# Altium project Vreg_Learning_Platform.PrjPcb (part 4 of 5)

## Sheet Safety.SchDoc: <Project Name>
size A3; ApprovedBy: <Appr.>; Author: <Author>; CompanyName: Infineon Technologies AG; Engineer: <Rel.>; Organization: Infineon Technologies AG; Address1: IFAG DES S PS; Address2: Am Campeon 1-12  -  85579 Neubiberg  -  Germany; Address3: 85579 Neubiberg; Address4: Germany; DocumentNumber: 6; Revision: <Rev.>; SheetNumber: 6; SheetTotal: 9; Release: RC00; PageSetup: Record=PageOptions|CenterHorizontal=True|CenterVertical=True|PrintScale=1.01|XCorrection=1.00|YCorrection=1.00|PrintKind=0|BorderSize=5000000|LeftOffset=0|BottomOffset=0|Orientation=2|PaperLength=1000|PaperWidth=1000|Scale=100|PaperSource=7|PrintQuality=-4|MediaType=1|DitherType=10|PaperKind=A3|PrintScaleMode=1; Doc_ConfidentialStatus: <Doc_ConfidentialStatus>; Doc_Preliminary: <Doc_Preliminary>
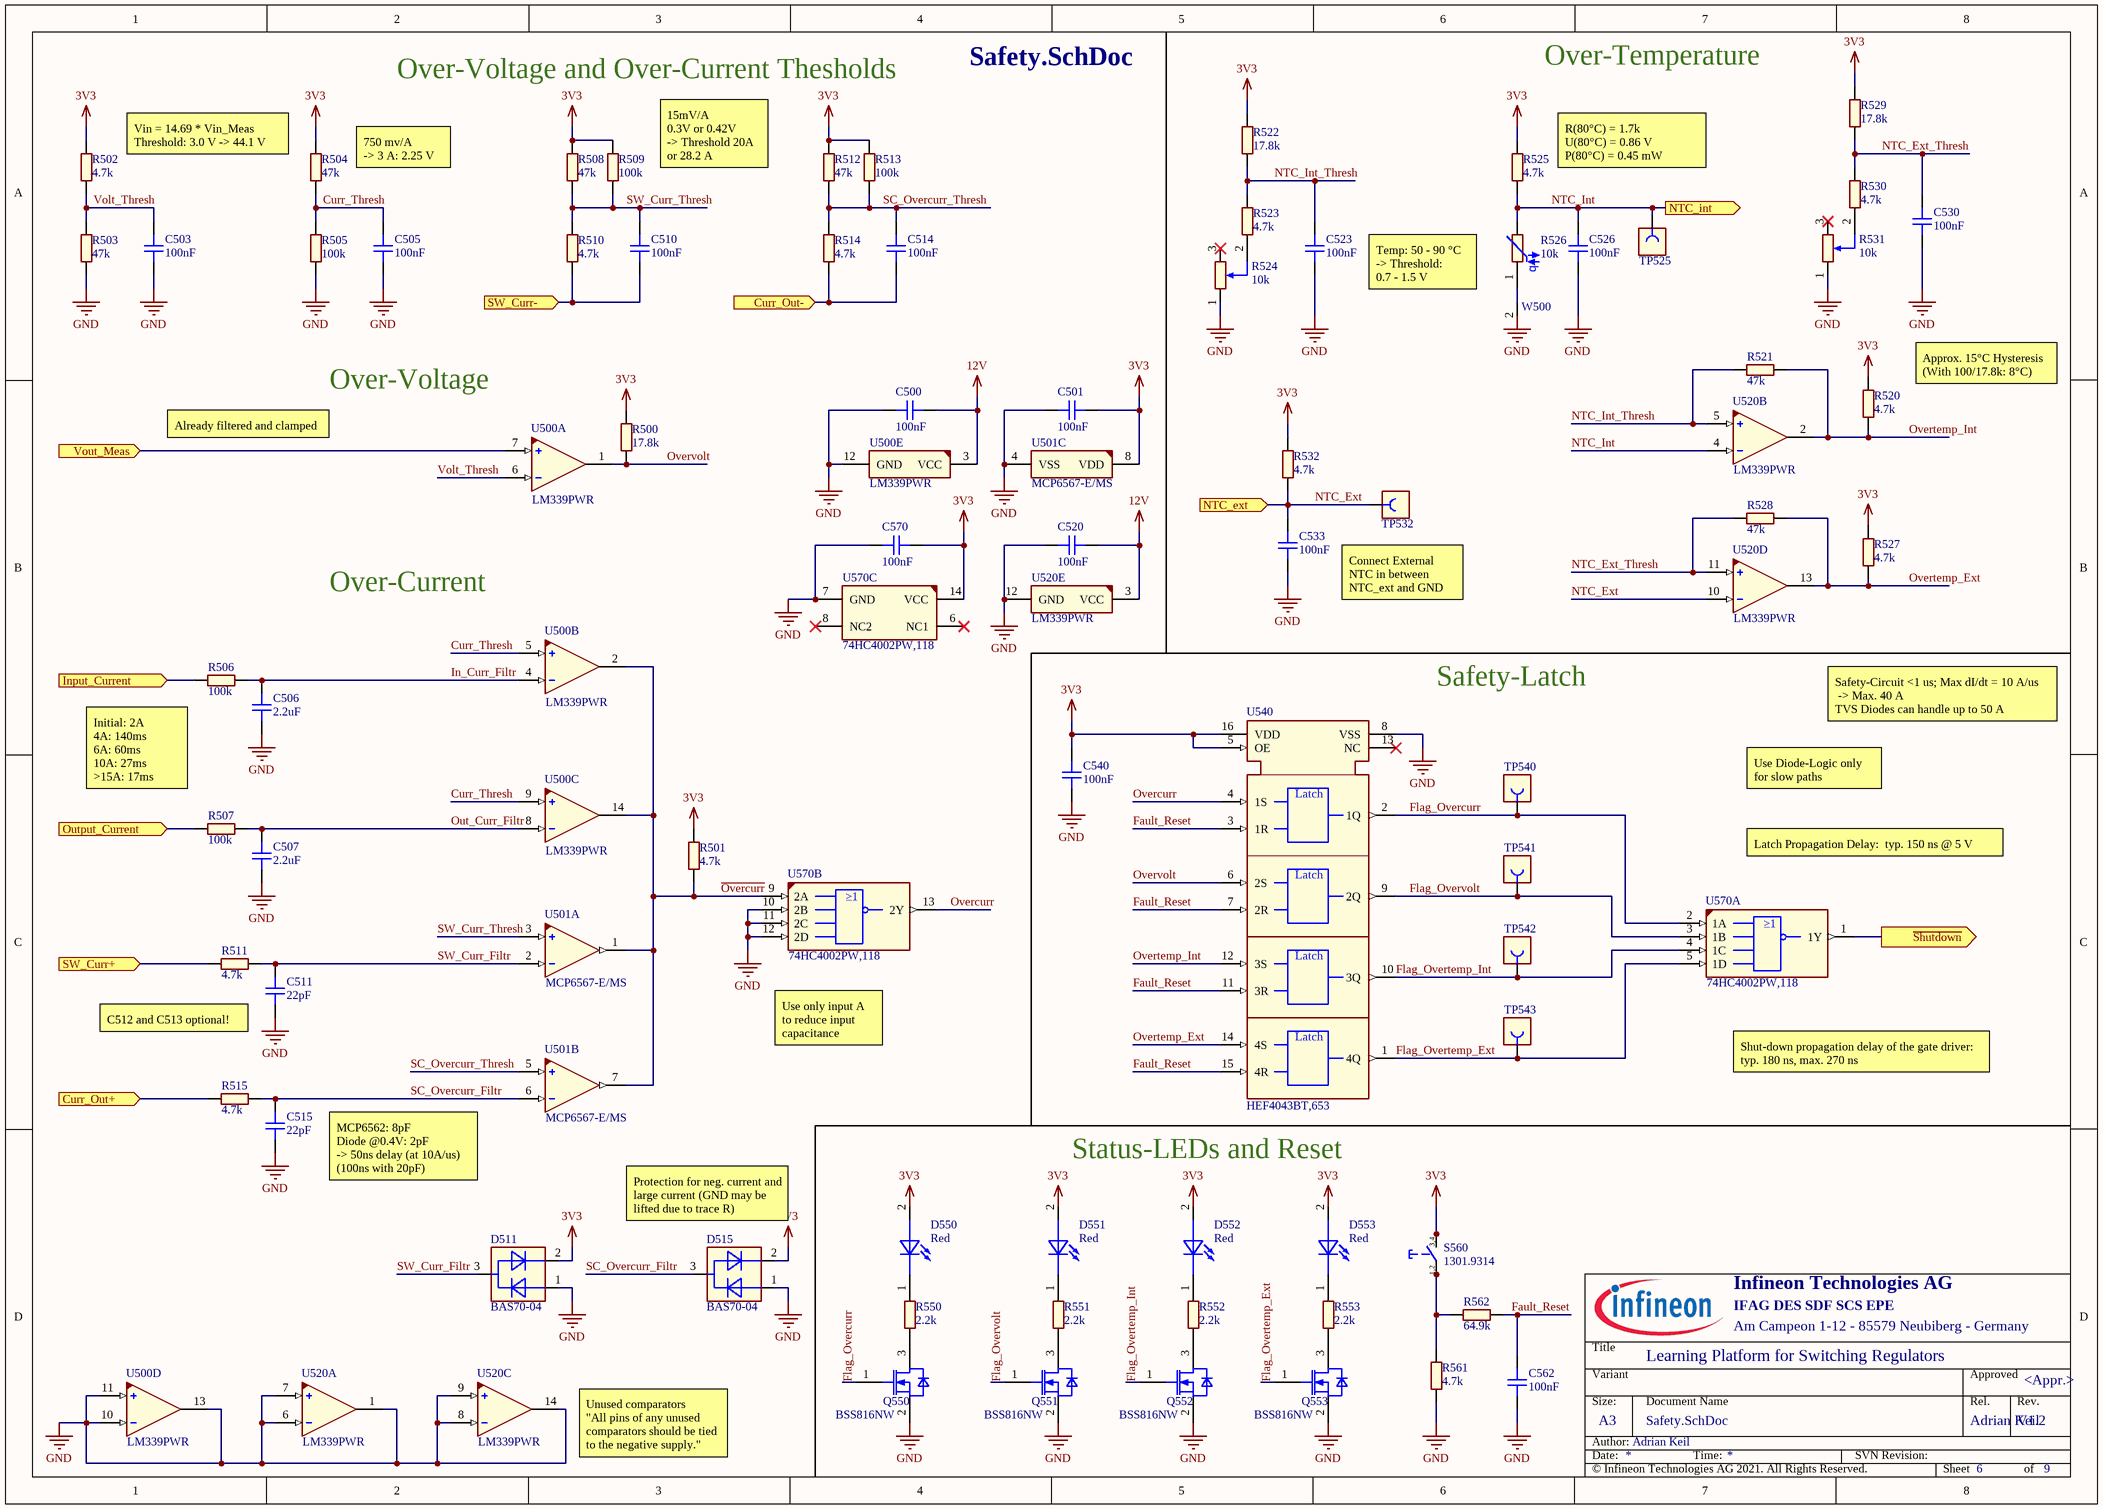
[diagram p4: Safety.SchDoc]

### Parts
C500  100nF  [CAPC1608X90N-2]
C501  100nF  [CAPC1608X90N-2]
C503  100nF  [CAPC1608X90N-2]
C505  100nF  [CAPC1608X90N-2]
C506  2.2uF  [CAPC1608X90N-3]
C507  2.2uF  [CAPC1608X90N-3]
C510  100nF  [CAPC1608X90N-2]
C511  22pF  [CAPC1608X90N-2]
C514  100nF  [CAPC1608X90N-2]
C515  22pF  [CAPC1608X90N-2]
C520  100nF  [CAPC1608X90N-2]
C523  100nF  [CAPC1608X90N-2]
C526  100nF  [CAPC1608X90N-2]
C530  100nF  [CAPC1608X90N-2]
C533  100nF  [CAPC1608X90N-2]
C540  100nF  [CAPC1608X90N-2]
C562  100nF  [CAPC1608X90N-2]
C570  100nF  [CAPC1608X90N-2]
D511  BAS70-04  [SOT95P240X110-3N-1]
D515  BAS70-04  [SOT95P240X110-3N-1]
D550  Red  [LEDSC160X80X80-2N-1]
D551  Red  [LEDSC160X80X80-2N-1]
D552  Red  [LEDSC160X80X80-2N-1]
D553  Red  [LEDSC160X80X80-2N-1]
Q550  BSS816NW  [SOT65P210X100-3N-1-V]
Q551  BSS816NW  [SOT65P210X100-3N-1-V]
Q552  BSS816NW  [SOT65P210X100-3N-1-V]
Q553  BSS816NW  [SOT65P210X100-3N-1-V]
R500  17.8k  [RESC1609X50N]
R501  4.7k  [RESC1609X50N]
R502  4.7k  [RESC1609X50N]
R503  47k  [RESC1609X50N]
R504  47k  [RESC1609X50N]
R505  100k  [RESC1609X50N]
R506  100k  [RESC1609X50N]
R507  100k  [RESC1609X50N]
R508  47k  [RESC1609X50N]
R509  100k  [RESC1609X50N]
R510  4.7k  [RESC1609X50N]
R511  4.7k  [RESC1609X50N]
R512  47k  [RESC1609X50N]
R513  100k  [RESC1609X50N]
R514  4.7k  [RESC1609X50N]
R515  4.7k  [RESC1609X50N]
R520  4.7k  [RESC1609X50N]
R521  47k  [RESC1609X50N]
R522  17.8k  [RESC1609X50N]
R523  4.7k  [RESC1609X50N]
R524  10k  [POT-SMD-3361P]
R525  4.7k  [RESC1609X50N]
R526  10k  [RESC1608X95N-1]
R527  4.7k  [RESC1609X50N]
R528  47k  [RESC1609X50N]
R529  17.8k  [RESC1609X50N]
R530  4.7k  [RESC1609X50N]
R531  10k  [POT-SMD-3361P]
R532  4.7k  [RESC1609X50N]
R550  2.2k  [RESC1609X50N]
R551  2.2k  [RESC1609X50N]
R552  2.2k  [RESC1609X50N]
R553  2.2k  [RESC1609X50N]
R561  4.7k  [RESC1609X50N]
R562  64.9k  [RESC1609X50N]
S560  1301.9314  [SW-SMD-1301.9314]
TP525  S1751-46R  [CON-SMD-TT-S1751-46]  (value not drawn)
TP532  S1751-46R  [CON-SMD-TT-S1751-46]  (value not drawn)
TP540  S1751-46R  [CON-SMD-TT-S1751-46]  (value not drawn)
TP541  S1751-46R  [CON-SMD-TT-S1751-46]  (value not drawn)
TP542  S1751-46R  [CON-SMD-TT-S1751-46]  (value not drawn)
TP543  S1751-46R  [CON-SMD-TT-S1751-46]  (value not drawn)
U500  LM339PWR  [SOP65P640X120-14N-1]  (parts A,B,C,D,E of 5)
U501  MCP6567-E/MS  [SOP65P490X110-8N-7-V]  (parts A,B,C of 3)
U520  LM339PWR  [SOP65P640X120-14N-1]  (parts A,B,C,D,E of 5)
U540  HEF4043BT,653  [SOIC127P600X175-16N-6]
U570  74HC4002PW,118  [SOP65P640X110-14N-1]  (parts A,B,C of 3)
W500  Net_Tie_2  [Net_Tie_Small_2P]  (value not drawn)  (net tie, no BOM)

### Ports
Curr_Out+ (in), Curr_Out- (in), Input_Current (in), NTC_ext (in), NTC_int (out), Output_Current (in), SW_Curr+ (in), SW_Curr- (in), Vout_Meas (in), ~{Shutdown} (out)

### Nets
3V3: C501.1 C540.2 C570.1 D511.2(CATHODE) D515.2(CATHODE) D550.2(Anode) D551.2(Anode) D552.2(Anode) D553.2(Anode) R500.1 R501.1 R502.1 R504.1 R508.1 R509.2 R512.1 R513.2 R520.1 R522.2 R525.1 R527.1 R529.2 R532.1 S560.3 S560.4 U501.8(VDD) U540.5(OE) U540.16(VDD) U570.14(VCC)
12V: C500.1 C520.1 U500.3(VCC) U520.3(VCC)
GND: C500.2 C501.2 C503.1 C505.1 C506.1 C507.1 C511.1 C515.1 C520.2 C523.1 C526.1 C530.1 C533.1 C540.1 C562.2 C570.2 D511.1(ANODE) D515.1(ANODE) Q550.2(SOURCE) Q551.2(SOURCE) Q552.2(SOURCE) Q553.2(SOURCE) R503.2 R505.1 R524.1 R531.1 R561.1 U500.10(4IN_N) U500.11(4IN_P) U500.12(GND) U500.13(4OUT) U501.4(VSS) U520.1(1OUT) U520.6(1IN_N) U520.7(1IN_P) U520.8(3IN_N) U520.9(3IN_P) U520.12(GND) U520.14(3OUT) U540.8(VSS) U570.7(GND) U570.10(2B) U570.11(2C) U570.12(2D) W500.2
~{Overcurr}: R501.2 U500.2(2OUT) U500.14(3OUT) U501.1(OUTA) U501.7(OUTB) U570.9(2A)
~{Shutdown}: U570.1(1Y) ; port ~{Shutdown}
Curr_Out+: R515.1 ; port Curr_Out+
Curr_Out-: C514.1 R514.2 ; port Curr_Out-
Curr_Thresh: C505.2 R504.2 R505.2 U500.5(2IN_P) U500.9(3IN_P)
Fault_Reset: C562.1 R562.2 U540.3(1R) U540.7(2R) U540.11(3R) U540.15(4R)
Flag_Overcurr: Q550.1(GATE) TP540.1 U540.2(1Q) U570.2(1A)
Flag_Overtemp_Ext: Q553.1(GATE) TP543.1 U540.1(4Q) U570.5(1D)
Flag_Overtemp_Int: Q552.1(GATE) TP542.1 U540.10(3Q) U570.4(1C)
Flag_Overvolt: Q551.1(GATE) TP541.1 U540.9(2Q) U570.3(1B)
In_Curr_Filtr: C506.2 R506.1 U500.4(2IN_N)
Input_Current: R506.2 ; port Input_Current
NTC_ext: C533.2 R532.2 TP532.1 U520.10(4IN_N) ; port NTC_ext
NTC_Ext_Thresh: C530.2 R528.1 R529.1 R530.1 U520.11(4IN_P)
NTC_int: C526.2 R525.2 R526.2 TP525.1 U520.4(2IN_N) ; port NTC_int
NTC_Int_Thresh: C523.2 R521.1 R522.1 R523.1 U520.5(2IN_P)
Out_Curr_Filtr: C507.2 R507.1 U500.8(3IN_N)
Output_Current: R507.2 ; port Output_Current
Overcurr: U540.4(1S) U570.13(2Y)
Overtemp_Ext: R527.2 R528.2 U520.13(4OUT) U540.14(4S)
Overtemp_Int: R520.2 R521.2 U520.2(2OUT) U540.12(3S)
Overvolt: R500.2 U500.1(1OUT) U540.6(2S)
SC_Overcurr_Filtr: C515.2 D515.3(ANODE_/_CATHODE) R515.2 U501.6(INB_N)
SC_Overcurr_Thresh: C514.2 R512.2 R513.1 R514.1 U501.5(INB_P)
SW_Curr+: R511.1 ; port SW_Curr+
SW_Curr-: C510.1 R510.2 ; port SW_Curr-
SW_Curr_Filtr: C511.2 D511.3(ANODE_/_CATHODE) R511.2 U501.2(INA_N)
SW_Curr_Thresh: C510.2 R508.2 R509.1 R510.1 U501.3(INA_P)
Volt_Thresh: C503.2 R502.2 R503.1 U500.6(1IN_N)
Vout_Meas: U500.7(1IN_P) ; port Vout_Meas
NetD550_1: D550.1(Cathode) R550.1
NetD551_1: D551.1(Cathode) R551.1
NetD552_1: D552.1(Cathode) R552.1
NetD553_1: D553.1(Cathode) R553.1
NetQ550_3: Q550.3(DRAIN) R550.2
NetQ551_3: Q551.3(DRAIN) R551.2
NetQ552_3: Q552.3(DRAIN) R552.2
NetQ553_3: Q553.3(DRAIN) R553.2
NetR523_2: R523.2 R524.2
NetR526_1: R526.1 W500.1
NetR530_2: R530.2 R531.2
NetR561_2: R561.2 R562.1 S560.1 S560.2

Not connected (* = marked no-connect by the designer): R524 3*; R531 3*; U540 13(NC)*; U570 6(NC1)* 8(NC2)*

### Notes on the sheet
- Over-Voltage and Over-Current Thesholds
- Over-Temperature
- Vin = 14.69 * Vin_Meas
  Threshold: 3.0 V -> 44.1 V
- (near R504) 750 mv/A
  -> 3 A: 2.25 V
- 15mV/A
  0.3V or 0.42V
  -> Threshold 20A or 28.2 A
- R(80°C) = 1.7k
  U(80°C) = 0.86 V
  P(80°C) = 0.45 mW
  Self-Heating: 1mW/℃ (at 25 °C)
- Temp: 50 - 90 °C
  -> Threshold:
  0.7 - 1.5 V
- (near R520) Approx. 15°C Hysteresis
  (With 100/17.8k: 8°C)
- Already filtered and clamped
- Over-Voltage
- Over-Current
- Connect External NTC in between NTC_ext and GND
- Safety-Latch
- Safety-Circuit <1 us; Max dI/dt = 10 A/us
  -> Max. 40 A
  TVS Diodes can handle up to 50 A
- Initial: 2A
  4A: 140ms
  6A: 60ms
  10A: 27ms
  >15A: 17ms
- Use Diode-Logic only for slow paths
- Latch Propagation Delay:  typ. 150 ns @ 5 V
- C512 and C513 optional!
- Use only input A to reduce input capacitance
- Shut-down propagation delay of the gate driver: typ. 180 ns, max. 270 ns
- MCP6562: 8pF
  Diode @0.4V: 2pF
  -> 50ns delay (at 10A/us)
  (100ns with 20pF)
- Status-LEDs and Reset
- (near D515) Protection for neg. current and large current (GND may be lifted due to trace R)
- (near U520) Unused comparators
  "All pins of any unused comparators should be tied to the negative supply."
- Title
- Variant
- Approved
- Date:
- Author:
- Size:
- A3
- Document Name
- Time:
- SVN Revision:
- Rel.
- Rev.
- Sheet
- of
- (in symbol 380147) 3,4; 1,2
- (in symbol 466242) q
- (in symbol 648079) Latch
- (in symbol 648286, part A) ≥1
- (in symbol 648286, part B) ≥1

### Library data of the parts
C500 C501 C503 C505 C510 C514 C520 C523 C526 C530 C533 C540 C562 C570 = 479045: CAP / CERA / 100nF / 50V / 10% / X7R (EIA) / -55°C to 125°C / 0603 / SMD / -; Multiple Parts: No; Manufacturer: AVX; Manufacturer Order Number: 06035C104KAT2A; Symbol Type: Capacitor; Single; Standard; 2 Pins; Alternate View: Yes; Article Number: 479045; Version Number: V01; Combined Parameters: TC:X7R (EIA);Tol.:-10%/+10%;Vdc:50V; QuickPick: 100nF / 50V / 10% / X7R (EIA) / 0603; Type: Standard; Style: Single; ComponentStatus: Released; PLMStatus: Active; Part Type: Capacitor; Value: 100nF; Tolerance Neg: 10%; Tolerance Pos: 10%; Application: Standard; Technology: Ceramic; Temperature min: -55; Temperature max: 125; Temperature Range: Military; ROHS Compliant: Y; Automotive Qualified: No; PackageReference: 0603; ComponentLink1Description: Vendor WebSite; ComponentLink1URL: http://www.avx.com; ComponentLink2Description: Datasheet; ComponentLink2URL: http://webnetprod.muc.infineon.com/PCBPortal_Prod/WorkFlows/AltiumComponent/StandardDocumentation?Versionid=479046; Supplier 1: Farnell; Supplier Part Number 1: 2280883; Supplier 2: DigiKey; Supplier Part Number 2: 478-5052-2-ND; Supplier 3: Mouser; Supplier Part Number 3: 581-06035C104KAT2A; Second Source allowed: Yes; Voltage DC (max): 50V; Package Description: Capacitor,non-polarized,Chip;1.60mm L X 0.81mm W X 0.90mm H
C506 C507 = 310650: CAP / CERA / 2.2uF / 25V / 10% / X5R (EIA) / -55°C to 85°C / 0603(1608) / SMD / -; Multiple Parts: No; Legacy PartNumber: CAP01010924; Manufacturer: MuRata; Manufacturer Order Number: GRM188R61E225KA12D; Symbol Type: Capacitor; Single; Standard; 2 Pins; Alternate View: Yes; Article Number: 310650; Version Number: V01; Combined Parameters: TC:X5R (EIA);Tol.:-10%/+10%;Vdc:25V; QuickPick: 2.2uF / 25V / 10% / X5R (EIA) / 0603 (1608M); Type: Standard; Style: Single; Package Metric: 1608; Package Imperial: 0603; ComponentStatus: Released; PLMStatus: Active; Legacy DeviceID: CAP01010924; Part Type: Capacitor; Value: 2.2uF; Tolerance Neg: 10%; Tolerance Pos: 10%; Technology: Ceramic; Temperature min: -55; Temperature max: 85; Temperature Range: Military; ROHS Compliant: Y; Automotive Qualified: No; PackageReference: 0603 (1608M); ComponentLink1Description: Vendor WebSite; ComponentLink1URL: http://www.murata.com/; ComponentLink2Description: Datasheet; ComponentLink2URL: http://webnetprod.muc.infineon.com/PCBPortal_Prod/WorkFlows/AltiumComponent/StandardDocumentation?Versionid=310651; Supplier 1: Farnell; Supplier Part Number 1: 1845734RL; Supplier 2: DigiKey; Supplier Part Number 2: 490-10731-2-ND; Supplier 3: Mouser; Supplier Part Number 3: 81-GRM188R61E225KA2D; Second Source allowed: Yes; Voltage DC (max): 25V; Package Description: Capacitor,non-polarized,Chip;1.60mm L X 0.80mm W X 0.90mm H
C511 C515 = 252438: CAP / CERA / 22pF / 50V / 10% / C0G (EIA) / NP0 / -55°C to 125°C / 0603 / SMD / -; Multiple Parts: No; Legacy PartNumber: CAP00400027; Manufacturer: AVX; Manufacturer Order Number: 06035A220K4T2A; Symbol Type: Capacitor; Single; Standard; 2 Pins; Alternate View: Yes; Article Number: 252438; Version Number: V01; Combined Parameters: TC:C0G (EIA) / NP0;Tol.:-10%/+10%;Vdc:50V; QuickPick: 22pF / 50V / 10% / C0G (EIA) / NP0 / 0603; Type: Standard; Style: Single; Automotive Qualified: AEC Q200; ComponentStatus: Released; PLMStatus: Active; Legacy DeviceID: CAP00400027; Part Type: Capacitor; Value: 22pF; Tolerance Neg: 10%; Tolerance Pos: 10%; Technology: Ceramic; Temperature min: -55; Temperature max: 125; Temperature Range: Military; ROHS Compliant: Y; PackageReference: 0603; ComponentLink1Description: Vendor WebSite; ComponentLink1URL: http://www.avx.com; ComponentLink2Description: Datasheet; ComponentLink2URL: http://webnetprod.muc.infineon.com/PCBPortal_Prod/WorkFlows/AltiumComponent/StandardDocumentation?Versionid=252439; Supplier 1: Farnell; Supplier 2: DigiKey; Supplier Part Number 2: 06035A220K4T2A-ND; Supplier 3: Mouser; Supplier Part Number 3: 581-06035A220K4T2A; Second Source allowed: Yes; Voltage DC (max): 50V; Package Description: Capacitor,non-polarized,Chip;1.60mm L X 0.81mm W X 0.90mm H
D511 D515 = 423882: Silicon Schottky Diode; Legacy PartNumber: IFX01400573; Manufacturer: Infineon Technologies; Symbol Type: Dual Diode Symbol 3 Pins, 1 Anode , 2 Cathode, 3 Anode, Cathode; Article Number: 423882; Version Number: V01; Combined Parameters: Vf:880mV;If:70mA;Ur:70V;Ir:100nA;Pmax:250mW; QuickPick: Schottky Diode / SOT23; Style: Single; Automotive Qualified: AEC Q101; ComponentStatus: Released; PLMStatus: Active; Second Source allowed: Yes; Voltage DC (max): na; Legacy DeviceID: IFX01400573; Part Type: Diode; Manufacturer Order Number: BAS70-04; Value: BAS70-04; Type: Schottky Diode; Application: Standard; Temperature min: -55; Temperature max: 125; Temperature Range: Military; ROHS Compliant: Y; PackageReference: SOT23; ComponentLink1Description: Vendor WebSite; ComponentLink1URL: https://www.infineon.com/; ComponentLink2Description: Datasheet; ComponentLink2URL: http://webnetprod.muc.infineon.com/PCBPortal_Prod/WorkFlows/AltiumComponent/StandardDocumentation?Versionid=423883; Supplier 1: Farnell; Supplier Part Number 1: 1056501; Supplier 2: DigiKey; Supplier Part Number 2: BAS7004E6327HTSA1TR-ND; Supplier 3: Mouser; Supplier Part Number 3: 726-BAS7004E6327HTSA; Package Description: SOT,0.95mm pitch;3 pin,1.30mm W X 2.90mm L X 1.10mm H body
D550-D553 = 625459: WL-SMCW SMT Mono-color Chip LED Waterclear, Red,630nm; Manufacturer: Wurth Elektronik; Manufacturer Order Number: 150060RS75000; Symbol Type: Standard LED Symbol, 1 Cathode, 2 Anode; Article Number: 625459; Version Number: V01; Combined Parameters: Vf:2.4V;If:30mA;Ur:5V;Ir:10uA;Pmax:72mW; QuickPick: LED / 1608 (0603); Style: Single; Automotive Qualified: No; ComponentStatus: Released; PLMStatus: Active; Second Source allowed: Yes; Voltage DC (max): na; Part Type: Diode; Value: Red; Type: LED; Application: Standard; Temperature min: -40; Temperature max: 85; Temperature Range: Industrial; ROHS Compliant: Y; PackageReference: 1608 (0603); ComponentLink1Description: Vendor WebSite; ComponentLink1URL: http://www.we-online.com; ComponentLink2Description: Datasheet; ComponentLink2URL: http://webnetprod.muc.infineon.com/PCBPortal_Prod/WorkFlows/AltiumComponent/StandardDocumentation?Versionid=625460; Supplier 1: Farnell; Supplier Part Number 1: 2322071; Supplier 2: DigiKey; Supplier Part Number 2: 732-4978-1-ND; Supplier 3: Mouser; Supplier Part Number 3: 710-150060RS75000; Package Description: LED,Side Concave; 2 pin,1.60mm W X 0.80mm L X 0.80mm H
Q550-Q553 = 644598: OptiMOS 2 Small-Signal-Transistor; Manufacturer: Infineon Technologies; Symbol Type: Insulated-Gate Field-Effect Transistor (IGFET), N-Channel, Depletion,  Body Diode, Pin 1 Gate, 2 Source, 3 Drain, 3 Pins; Article Number: 644598; Version Number: V01; Legacy DeviceID: IFX_BSS816NW; Combined Parameters: N-Channel Enhancement;Uds:20V;Id:1.4A;Rds:240R;P:500mW; QuickPick: N-Channel Enhancement / 500mW / 1.4A / 20V / PG-SOT323-3-2; Type: N-Channel Enhancement; Style: Single; Automotive Qualified: AEC Q101; ComponentStatus: Released; PLMStatus: Active; Second Source allowed: Yes; Voltage DC (max): na; Part Type: Transistor FET; Manufacturer Order Number: BSS816NW; Value: BSS816NW; Application: Small Signal; Temperature min: -55; Temperature max: 150; Temperature Range: Military; ROHS Compliant: Y; PackageReference: PG-SOT323-3-2; ComponentLink1Description: Vendor WebSite; ComponentLink1URL: https://www.infineon.com/; ComponentLink2Description: Datasheet; ComponentLink2URL: http://webnetprod.muc.infineon.com/PCBPortal_Prod/WorkFlows/AltiumComponent/StandardDocumentation?Versionid=644599; Supplier 1: Farnell; Supplier Part Number 1: 2617470; Supplier 2: DigiKey; Supplier Part Number 2: BSS816NWH6327XTSA1CT-ND; Supplier 3: Mouser; Supplier Part Number 3: 726-SP000917562; Package Description: SOT,0.65mm pitch;3 pin,1.25mm W X 2.00mm L X 1.00mm H body
R500 R522 R529 = 346302: RES / STD / 17.8k / 100mW / 1% / 100ppm/K / -55°C to 155°C / 0603 / SMD / -; Multiple Parts: No; Legacy PartNumber: RES01801283; Manufacturer: Vishay; Manufacturer Order Number: CRCW060317K8FK; Symbol Type: Resistor; Single; Standard; 2 Pins; Alternate View: Yes; Article Number: 346302; Version Number: V01; Combined Parameters: TCR:100ppm/K;Tol.:-1%/+1%;Vdc:75V;Idc:-;P:100mW; QuickPick: 17.8k / 1% / 0.1 / 0603; Style: Single; Automotive Qualified: AEC Q200; ComponentStatus: Released; PLMStatus: Active; Voltage DC (max): 75V; Legacy DeviceID: RES01801283; Part Type: Resistor; Value: 17.8k; Tolerance Neg: 1%; Tolerance Pos: 1%; Type: Standard; Technology: Thick Film; Temperature min: -55; Temperature max: 155; Temperature Range: Military; ROHS Compliant: Y; PackageReference: 0603; ComponentLink1Description: Vendor WebSite; ComponentLink1URL: http://www.vishay.com; ComponentLink2Description: Datasheet; ComponentLink2URL: http://webnetprod.muc.infineon.com/PCBPortal_Prod/WorkFlows/AltiumComponent/StandardDocumentation?Versionid=346303; Supplier 1: Farnell; Supplier 2: DigiKey; Supplier 3: Mouser; Second Source allowed: Yes
R501 R502 R510 R511 R514 R515 R520 R523 R525 R527 R530 R532 R561 = 345982: RES / STD / 4.7k / 100mW / 1% / 100ppm/K / -55°C to 155°C / 0603 / SMD / -; Multiple Parts: No; Legacy PartNumber: RES01801219; Manufacturer: Vishay; Manufacturer Order Number: CRCW06034K70FK; Symbol Type: Resistor; Single; Standard; 2 Pins; Alternate View: Yes; Article Number: 345982; Version Number: V01; Combined Parameters: TCR:100ppm/K;Tol.:-1%/+1%;Vdc:75V;Idc:-;P:100mW; QuickPick: 4.7k / 1% / 0.1 / 0603; Style: Single; Automotive Qualified: AEC Q200; ComponentStatus: Released; PLMStatus: Active; Voltage DC (max): 75V; Legacy DeviceID: RES01801219; Part Type: Resistor; Value: 4.7k; Tolerance Neg: 1%; Tolerance Pos: 1%; Type: Standard; Technology: Thick Film; Temperature min: -55; Temperature max: 155; Temperature Range: Military; ROHS Compliant: Y; PackageReference: 0603; ComponentLink1Description: Vendor WebSite; ComponentLink1URL: http://www.vishay.com; ComponentLink2Description: Datasheet; ComponentLink2URL: http://webnetprod.muc.infineon.com/PCBPortal_Prod/WorkFlows/AltiumComponent/StandardDocumentation?Versionid=345983; Supplier 1: Farnell; Supplier 2: DigiKey; Supplier 3: Mouser; Second Source allowed: Yes
R503 R504 R508 R512 R521 R528 = 346552: RES / STD / 47k / 100mW / 1% / 100ppm/K / -55°C to 155°C / 0603 / SMD / -; Multiple Parts: No; Legacy PartNumber: RES01801333; Manufacturer: Vishay; Manufacturer Order Number: CRCW060347K0FK; Symbol Type: Resistor; Single; Standard; 2 Pins; Alternate View: Yes; Article Number: 346552; Version Number: V01; Combined Parameters: TCR:100ppm/K;Tol.:-1%/+1%;Vdc:75V;Idc:-;P:100mW; QuickPick: 47k / 1% / 0.1 / 0603; Style: Single; Automotive Qualified: AEC Q200; ComponentStatus: Released; PLMStatus: Active; Voltage DC (max): 75V; Legacy DeviceID: RES01801333; Part Type: Resistor; Value: 47k; Tolerance Neg: 1%; Tolerance Pos: 1%; Type: Standard; Technology: Thick Film; Temperature min: -55; Temperature max: 155; Temperature Range: Military; ROHS Compliant: Y; PackageReference: 0603; ComponentLink1Description: Vendor WebSite; ComponentLink1URL: http://www.vishay.com; ComponentLink2Description: Datasheet; ComponentLink2URL: http://webnetprod.muc.infineon.com/PCBPortal_Prod/WorkFlows/AltiumComponent/StandardDocumentation?Versionid=346553; Supplier 1: Farnell; Supplier 2: DigiKey; Supplier Part Number 2: 541-47.0KHCT-ND; Supplier 3: Mouser; Second Source allowed: Yes
R505-R507 R509 R513 = 346742: RES / STD / 100k / 100mW / 1% / 100ppm/K / -55°C to 155°C / 0603 / SMD / -; Multiple Parts: No; Legacy PartNumber: RES01801371; Manufacturer: Vishay; Manufacturer Order Number: CRCW0603100KFK; Symbol Type: Resistor; Single; Standard; 2 Pins; Alternate View: Yes; Article Number: 346742; Version Number: V01; Combined Parameters: TCR:100ppm/K;Tol.:-1%/+1%;Vdc:75V;Idc:-;P:100mW; QuickPick: 100k / 1% / 0.1 / 0603; Style: Single; Automotive Qualified: AEC Q200; ComponentStatus: Released; PLMStatus: Active; Voltage DC (max): 75V; Legacy DeviceID: RES01801371; Part Type: Resistor; Value: 100k; Tolerance Neg: 1%; Tolerance Pos: 1%; Type: Standard; Technology: Thick Film; Temperature min: -55; Temperature max: 155; Temperature Range: Military; ROHS Compliant: Y; PackageReference: 0603; ComponentLink1Description: Vendor WebSite; ComponentLink1URL: http://www.vishay.com; ComponentLink2Description: Datasheet; ComponentLink2URL: http://webnetprod.muc.infineon.com/PCBPortal_Prod/WorkFlows/AltiumComponent/StandardDocumentation?Versionid=346743; Supplier 1: Farnell; Supplier Part Number 1: 1469649; Supplier 2: DigiKey; Supplier 3: Mouser; Second Source allowed: Yes
R524 R531 = 630020: RES / VAR / 10k / 500mW / 10% / 100ppm/K / -55°C to 125°C /  3 pin, 7.04 mm L X 6.71 mm W X 5.84 mm H Body / SMD / -; Multiple Parts: No; Manufacturer: Bourns; Manufacturer Order Number: 3361P-1-103GLF; Alternate View: Yes; Symbol Type: Resistor; Single; Variable; 3 Pins; Article Number: 630020; Version Number: V01; Combined Parameters: TCR:100ppm/K;Tol.:-10%/+10%;Vdc:-;Idc:-;P:500mW; QuickPick: 10k / 10% / 0.5 / SMD; Style: Single; ComponentStatus: Released; PLMStatus: Active; Part Type: Resistor; Value: 10k; Tolerance Neg: 10%; Tolerance Pos: 10%; Type: Variable; Application: Standard; Temperature min: -55; Temperature max: 125; Temperature Range: Military; ROHS Compliant: Y; Automotive Qualified: No; PackageReference: SMD; ComponentLink1Description: Vendor WebSite; ComponentLink1URL: http://www.bourns.com; ComponentLink2Description: Datasheet; ComponentLink2URL: http://webnetprod.muc.infineon.com/PCBPortal_Prod/WorkFlows/AltiumComponent/StandardDocumentation?Versionid=630021; Supplier 1: Farnell; Supplier Part Number 1: 1696060; Supplier 2: DigiKey; Supplier Part Number 2: 3361P-103GLFCT-ND; Supplier 3: Mouser; Supplier Part Number 3: 652-3361P-1-103GLF; Second Source allowed: Yes; Package Description: Potentiometer, SMD; 3 pin, 7.04 mm L X 6.71 mm W X 5.84 mm H Body
R526 = 466242: RES / NTC / 10k / 100mW / 1% / - / -40°C to 125°C / 0603(1608) / SMD / -; Multiple Parts: No; Legacy PartNumber: RES01806219; Manufacturer: MuRata; Manufacturer Order Number: NCP18XH103F03RB; Symbol Type: Resistor; Single; Negative Temperature Coefficient; 2 Pins; Alternate View: Yes; Article Number: 466242; Version Number: V01; Combined Parameters: TCR:-;Tol.:-1%/+1%;Vdc:-;Idc:-;P:100mW; QuickPick: 10k / 1% / 0.1 / 0603; Style: Single; Package Metric: 1608; Package Imperial: 0603; ComponentStatus: Released; PLMStatus: Active; Legacy DeviceID: RES01806219; Part Type: Resistor; Value: 10k; Tolerance Neg: 1%; Tolerance Pos: 1%; Type: Negative Temperature Coefficient (NTC); Temperature min: -40; Temperature max: 125; Temperature Range: Automotive; ROHS Compliant: Y; Automotive Qualified: No; PackageReference: 0603; ComponentLink1Description: Vendor WebSite; ComponentLink1URL: http://www.murata.com/; ComponentLink2Description: Datasheet; ComponentLink2URL: http://webnetprod.muc.infineon.com/PCBPortal_Prod/WorkFlows/AltiumComponent/StandardDocumentation?Versionid=466243; Supplier 1: Farnell; Supplier Part Number 1: 2456122RL; Supplier 2: DigiKey; Supplier Part Number 2: 490-4800-2-ND; Supplier 3: Mouser; Supplier Part Number 3: 81-NCP18XH103F03RB; Second Source allowed: Yes; Package Description: Resistor,Chip;1.60mm L X 0.80mm W X 0.95mm H
R550-R553 = 345782: RES / STD / 2.2k / 100mW / 1% / 100ppm/K / -55°C to 155°C / 0603 / SMD / -; Multiple Parts: No; Legacy PartNumber: RES01801179; Manufacturer: Vishay; Manufacturer Order Number: CRCW06032K20FK; Symbol Type: Resistor; Single; Standard; 2 Pins; Alternate View: Yes; Article Number: 345782; Version Number: V01; Combined Parameters: TCR:100ppm/K;Tol.:-1%/+1%;Vdc:75V;Idc:-;P:100mW; QuickPick: 2.2k / 1% / 0.1 / 0603; Style: Single; Automotive Qualified: AEC Q200; ComponentStatus: Released; PLMStatus: Active; Voltage DC (max): 75V; Legacy DeviceID: RES01801179; Part Type: Resistor; Value: 2.2k; Tolerance Neg: 1%; Tolerance Pos: 1%; Type: Standard; Technology: Thick Film; Temperature min: -55; Temperature max: 155; Temperature Range: Military; ROHS Compliant: Y; PackageReference: 0603; ComponentLink1Description: Vendor WebSite; ComponentLink1URL: http://www.vishay.com; ComponentLink2Description: Datasheet; ComponentLink2URL: http://webnetprod.muc.infineon.com/PCBPortal_Prod/WorkFlows/AltiumComponent/StandardDocumentation?Versionid=345783; Supplier 1: Farnell; Supplier 2: DigiKey; Supplier 3: Mouser; Second Source allowed: Yes
R562 = 346637: RES / STD / 64.9k / 100mW / 1% / 100ppm/K / -55°C to 155°C / 0603 / SMD / -; Multiple Parts: No; Legacy PartNumber: RES01801350; Manufacturer: Vishay; Manufacturer Order Number: CRCW060364K9FK; Symbol Type: Resistor; Single; Standard; 2 Pins; Alternate View: Yes; Article Number: 346637; Version Number: V01; Combined Parameters: TCR:100ppm/K;Tol.:-1%/+1%;Vdc:75V;Idc:-;P:100mW; QuickPick: 64.9k / 1% / 0.1 / 0603; Style: Single; Automotive Qualified: AEC Q200; ComponentStatus: Released; PLMStatus: Active; Voltage DC (max): 75V; Legacy DeviceID: RES01801350; Part Type: Resistor; Value: 64.9k; Tolerance Neg: 1%; Tolerance Pos: 1%; Type: Standard; Technology: Thick Film; Temperature min: -55; Temperature max: 155; Temperature Range: Military; ROHS Compliant: Y; PackageReference: 0603; ComponentLink1Description: Vendor WebSite; ComponentLink1URL: http://www.vishay.com; ComponentLink2Description: Datasheet; ComponentLink2URL: http://webnetprod.muc.infineon.com/PCBPortal_Prod/WorkFlows/AltiumComponent/StandardDocumentation?Versionid=346638; Supplier 1: Farnell; Supplier 2: DigiKey; Supplier 3: Mouser; Second Source allowed: Yes
S560 = 380147: Pushbutton Tactile Switch, Single Pole Single Throw, 4 Pins; Legacy PartNumber: CON01500305; Manufacturer: Schurter; Symbol type: Tactile Switch, Spring Return, Single Pole Single Throw - Normally Open, 4 Pins; Article Number: 380147; Version Number: V01; Legacy DeviceID: SCH_1301.9314; ComponentStatus: Released; PLMStatus: Active; Second Source allowed: Yes; Voltage DC (max): na; Part Type: Electro Mechanic; Manufacturer Order Number: 1301.9314; Value: 1301.9314; Temperature min: -20; Temperature max: 70; Temperature Range: Commercial; ROHS Compliant: Y; ComponentLink1Description: Vendor WebSite; ComponentLink1URL: http://www.schurter.com.sg/; ComponentLink2Description: Datasheet; ComponentLink2URL: http://webnetprod.muc.infineon.com/PCBPortal_Prod/WorkFlows/AltiumComponent/StandardDocumentation?Versionid=380148; Supplier 1: Farnell; Supplier Part Number 1: 1217763; Supplier 2: DigiKey; Supplier Part Number 2: 1301.9314-ND; Supplier 3: Mouser; Supplier Part Number 3: 693-1301.9314; Package Description: SMD Switch, 6.00mm L X 6.00mm W X 4.3mm H body
TP525 TP532 TP540-TP543 = 387486: Test Terminal, Surface Mount (Tape and Reeled Components); Multiple Parts: No; Legacy PartNumber: CON01501015; Manufacturer: Harwin; Symbol Type: Connector, 1 Lead, Female; Alternate View: Yes; Article Number: 387486; Version Number: V01; Legacy DeviceID: HAR_S1751-46R; Combined Parameters: Board-to-Cable None (onboard);1x1;Mounting:SMT;Orient:None (onboard);Shielded:No; QuickPick: None (onboard) / Board-to-Cable; Style: Not Applicable; ComponentStatus: Released; PLMStatus: Active; Voltage DC (max): na; Part Type: Connector; Manufacturer Order Number: S1751-46R; Value: S1751-46R; Type: Board-to-Cable; Application: Test; Temperature min: 0; Temperature max: 0; Temperature Range: Military; ROHS Compliant: Y; Automotive Qualified: No; ComponentLink1Description: Vendor WebSite; ComponentLink1URL: http://www.harwin.com/; ComponentLink2Description: Datasheet; ComponentLink2URL: http://webnetprod.muc.infineon.com/PCBPortal_Prod/WorkFlows/AltiumComponent/StandardDocumentation?Versionid=387487; Supplier 1: Farnell; Supplier Part Number 1: 2411184; Supplier 2: DigiKey; Supplier Part Number 2: 952-1478-2-ND; Supplier 3: Mouser; Supplier Part Number 3: 855-S1751-46R; Second Source allowed: Yes; Package Description: Test Terminal, SMD, 3.25mm L X 1.65mm W X 2.15mm H body
U500 U520 = 409035: Quad Differential Comparator; Legacy PartNumber: IC02600564; Manufacturer: Texas Instruments; Alternate View: Yes; Article Number: 409035; Version Number: V01; Legacy DeviceID: TI_LM339; Combined Parameters: Res.:-;Fmax:-; QuickPick: TSSOP-14 (PW); Automotive Qualified: No; ComponentStatus: Released; PLMStatus: Active; Voltage DC (max): na; Symbol Type: Quad Differential Comparator; Part Type: Analog Parts; Manufacturer Order Number: LM339PWR; Value: LM339PWR; Temperature min: 0; Temperature max: 0; Temperature Range: Military; PackageReference: TSSOP-14 (PW); ComponentLink1Description: Vendor WebSite; ComponentLink1URL: http://www.ti.com; ComponentLink2Description: Datasheet; ComponentLink2URL: http://webnetprod.muc.infineon.com/PCBPortal_Prod/WorkFlows/AltiumComponent/StandardDocumentation?Versionid=409036; Supplier 1: Farnell; Supplier Part Number 1: 2436009; Supplier 2: DigiKey; Supplier Part Number 2: 296-6607-2-ND; Supplier 3: Mouser; Supplier Part Number 3: 595-LM339PWR; Second Source allowed: Yes
U501 = 648281: Low-Power Open-Drain Output Comparator; Manufacturer: Microchip Technology; Alternate View: Yes; Article Number: 648281; Version Number: V00; Legacy DeviceID: MT_MCP6567-E/MS; Combined Parameters: Res.:-;Fmax:4MHz; QuickPick: Comparator / MSOP-8 (MS); Automotive Qualified: No; ComponentStatus: Released; PLMStatus: Active; Voltage DC (max): na; Multiple Parts: Yes; Symbol Type: Low-Power Open-Drain Output Comparator; Part Type: Analog Parts; Manufacturer Order Number: MCP6567-E/MS; Value: MCP6567-E/MS; Type: Comparator; Application: Power Electronics; Temperature min: -40; Temperature max: 125; Temperature Range: Automotive; ROHS Compliant: Y; PackageReference: MSOP-8 (MS); ComponentLink1Description: Vendor WebSite; ComponentLink1URL: http://www.microchip.com/; ComponentLink2Description: Datasheet; ComponentLink2URL: http://webnetprod.muc.infineon.com/PCBPortal_Prod/WorkFlows/AltiumComponent/StandardDocumentation?Versionid=648282; Supplier 1: Farnell; Supplier Part Number 1: 1834862; Supplier 2: DigiKey; Supplier Part Number 2: MCP6567-E/MS-ND; Supplier 3: Mouser; Supplier Part Number 3: 579-MCP6567-E/MS; Second Source allowed: Yes; Package Description: SOP,0.65mm pitch;8 pin,3.00mm W X 3.00mm L X 1.10mm H body
U540 = 648079: Quad R/S latch with 3-state outputs; Multiple Parts: No; Manufacturer: Nexperia; Article Number: 648079; Version Number: V00; Legacy DeviceID: NEX_HEF4043BT,653; Combined Parameters: - Digital;Vdc min/max:3V/15V;Iout:2.4mA;Fmax:-; QuickPick: SO-16; ComponentStatus: Released; PLMStatus: Active; Second Source allowed: Yes; Voltage DC (max): na; Symbol Type: Quad R/S latch with 3-state outputs; Alternate View: No; Part Type: Integrated Circuit; Manufacturer Order Number: HEF4043BT,653; Value: HEF4043BT,653; Type: Digital; Temperature min: -40; Temperature max: 85; Temperature Range: Industrial; ROHS Compliant: Y; Automotive Qualified: No; PackageReference: SO-16; ComponentLink1Description: Vendor WebSite; ComponentLink1URL: http://www.nexperia.com; ComponentLink2Description: Datasheet; ComponentLink2URL: http://webnetprod.muc.infineon.com/PCBPortal_Prod/WorkFlows/AltiumComponent/StandardDocumentation?Versionid=648080; Supplier 1: Farnell; Supplier 2: DigiKey; Supplier Part Number 2: 1727-1799-1-ND; Supplier 3: Mouser; Supplier Part Number 3: 771-HEF4043BT653; Package Description: SOIC,1.27mm pitch;16 pin,3.90mm W X 9.90mm L X 1.75mm H body
U570 = 648286: Dual 4-input NOR gate, Inputs also include clamp diodes that enable the use of current limiting resistors; Manufacturer: Nexperia; Alternate View: Yes; Article Number: 648286; Version Number: V00; Legacy DeviceID: NEX_74HC4002PW,118; Combined Parameters: Power Electronics Digital;Vdc min/max:2V/6V;Iout:25mA;Fmax:-; QuickPick: TSSOP14 (SOT402-1); Automotive Qualified: No; ComponentStatus: Released; PLMStatus: Active; Voltage DC (max): na; Symbol Type: Dual 4-input NOR gate; Multiple Parts: Yes; Part Type: Integrated Circuit; Manufacturer Order Number: 74HC4002PW,118; Value: 74HC4002PW,118; Type: Digital; Application: Power Electronics; Temperature min: -40; Temperature max: 125; Temperature Range: Automotive; ROHS Compliant: Y; PackageReference: TSSOP14 (SOT402-1); ComponentLink1Description: Vendor WebSite; ComponentLink1URL: http://www.nexperia.com; ComponentLink2Description: Datasheet; ComponentLink2URL: http://webnetprod.muc.infineon.com/PCBPortal_Prod/WorkFlows/AltiumComponent/StandardDocumentation?Versionid=648287; Supplier 1: Farnell; Supplier Part Number 1: 3441850; Supplier 2: DigiKey; Supplier Part Number 2: 1727-6600-1-ND; Supplier 3: Mouser; Supplier Part Number 3: 771-HC4002PW118; Second Source allowed: Yes; Package Description: SOP,0.65mm,pitch;14 pin,4.40mm W X 5.00mm L X 1.10mm H body
W500 = 453053: SMD Net Tie for two Nets; Legacy PartNumber: CON01501379; Manufacturer: Infineon Technologies; Manufacturer Order Number: Net Tie_small_2p; Alternate View: Yes; Article Number: 453053; Version Number: V01; Legacy DeviceID: CON_Net Tie_small_2p; Value: Net Tie_small_2p; Combined Parameters: - onboard connector;-x-;Mounting:SMT;Orient:-;Shielded:-; ComponentStatus: Released; PLMStatus: Active; Voltage DC (max): na; Symbol Type: Net Tie for two Nets; Part Type: Connector; Temperature min: 0; Temperature max: 0; Temperature Range: Military; PackageReference: SMD; ComponentLink1Description: Vendor WebSite; ComponentLink1URL: https://www.infineon.com/; ComponentLink2Description: Datasheet; Supplier 1: Farnell; Supplier 2: DigiKey; Supplier 3: Mouser; Second Source allowed: Yes; Package Description: SMD Net Tie 0.2mm x 0.6mm